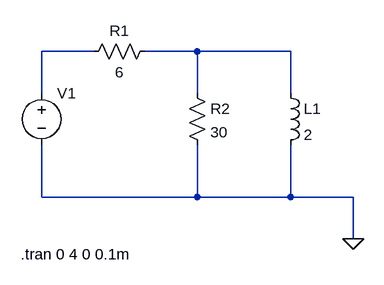
[diagram p0: schematic LTSpice PAR PR 10.asc]
LTSpice PAR PR 10.asc, the LTspice schematic file:
Version 4
SHEET 1 880 680
WIRE 112 80 32 80
WIRE 272 80 192 80
WIRE 416 80 272 80
WIRE 32 144 32 80
WIRE 272 144 272 80
WIRE 416 144 416 80
WIRE 32 304 32 224
WIRE 272 304 272 224
WIRE 272 304 32 304
WIRE 416 304 416 224
WIRE 416 304 272 304
WIRE 512 304 416 304
WIRE 512 368 512 304
FLAG 512 368 0
SYMBOL ind 400 128 R0
SYMATTR InstName L1
SYMATTR Value 2
SYMATTR SpiceLine Rser=0.001f
SYMBOL voltage 32 128 R0
WINDOW 3 24 96 Invisible 2
WINDOW 123 0 0 Left 0
WINDOW 39 0 0 Left 0
SYMATTR Value PULSE(0 6 1 0.001f 0.001f 1)
SYMATTR InstName V1
SYMBOL res 208 64 R90
WINDOW 0 0 56 VBottom 2
WINDOW 3 32 56 VTop 2
SYMATTR InstName R1
SYMATTR Value 6
SYMBOL res 256 128 R0
SYMATTR InstName R2
SYMATTR Value 30
TEXT 0 392 Left 2 !.tran 0 4 0 0.1m

The netlist it stands for:
* LTSpice PAR PR 10.asc
L1 N002 0 2 Rser=0.001f
V1 N001 0 PULSE(0 6 1 0.001f 0.001f 1)
R1 N002 N001 6
R2 N002 0 30
.tran 0 4 0 0.1m
.backanno
.end